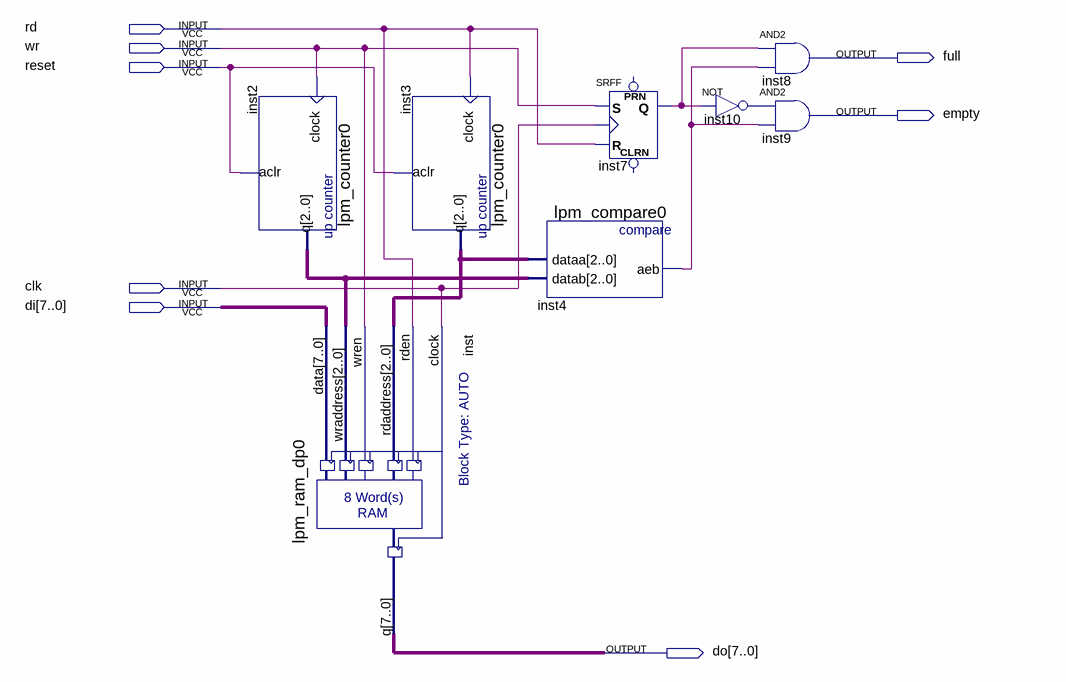
[diagram p0: schematic sheet]
// Quartus schematic fifog.bdf as structural Verilog: 8 symbols, 8 pins
module fifog (
  input  rd,
  input  wr,
  input  reset,
  input  clk,
  input  [7:0] di,
  output full,
  output empty,
  output [7:0] \do 
);

  wire inst4_aeb, inst7_q, inst10_out;
  wire [2:0] inst2_q, inst3_q;

  lpm_counter0 inst2 (.clock(wr), .aclr(reset), .q(inst2_q));
  lpm_ram_dp0 inst (.data(di), .wraddress(inst2_q), .wren(wr), .rdaddress(inst3_q), .rden(rd), .clock(clk), .q(\do ));
  lpm_counter0 inst3 (.clock(rd), .aclr(reset), .q(inst3_q));
  lpm_compare0 inst4 (.dataa(inst3_q), .datab(inst2_q), .aeb(inst4_aeb));
  SRFF inst7 (.S(wr), .R(rd), .CLK(clk), .Q(inst7_q));  // open: PRN, CLRN
  and inst8 (full, inst7_q, inst4_aeb);
  and inst9 (empty, inst10_out, inst4_aeb);
  not inst10 (inst10_out, inst7_q);
endmodule
